# EAGLE design rtc_version2 (EAGLE 5.11)
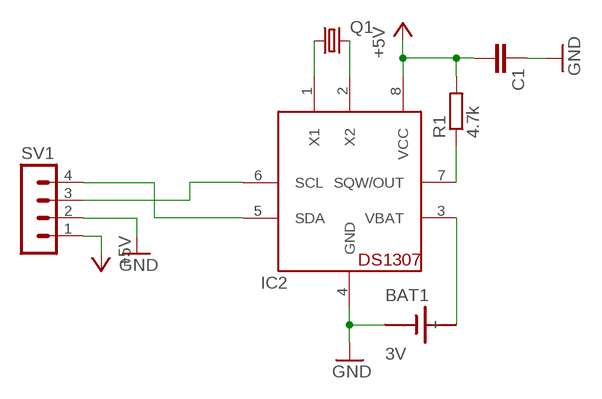
[diagram p0: schematic, sheet 1]

## Parts
BAT1  3V  SN2032  [SN2032]
C1  CAPPTH2  [CAP-PTH-SMALL2]
IC2  DS1307  [DIL08]
Q1  CRYSTALTC38H  [TC38H]
R1  4.7k  R-EU_0207/7  [0207/7]
SV1  MA04-1  [MA04-1]

## Nets
+5V: C1.2 IC2.8(VCC) R1.2 SV1.1
GND: BAT1.- C1.1 IC2.4(GND) SV1.2
N$1: IC2.2(X2) Q1.2
N$2: IC2.1(X1) Q1.1
N$3: BAT1.+ IC2.3(VBAT)
N$5: IC2.7(SQW/OUT) R1.1
SCL: IC2.6(SCL) SV1.3
SDA: IC2.5(SDA) SV1.4

## Library data of the parts
BAT1 = sn2032:SN2032: LI BATTERY
C1 = SparkFun:CAP: Capacitor Standard 0603 ceramic capacitor, and 0.1" leaded capacitor.
IC2 = adafruit:DS1307: DS1307 Real time clock (RTC) with battery backup ability. Talk to it via i2c
Q1 = SparkFun:CRYSTAL: Crystals Various standard crystals. Proven footprints. Spark Fun Electronics SKU : COM-00534
R1 = rcl:R-EU_: RESISTOR, European symbol
SV1 = con-lstb:MA04-1: PIN HEADER; OC_FARNELL: unknown; OC_NEWARK: unknown

## Board
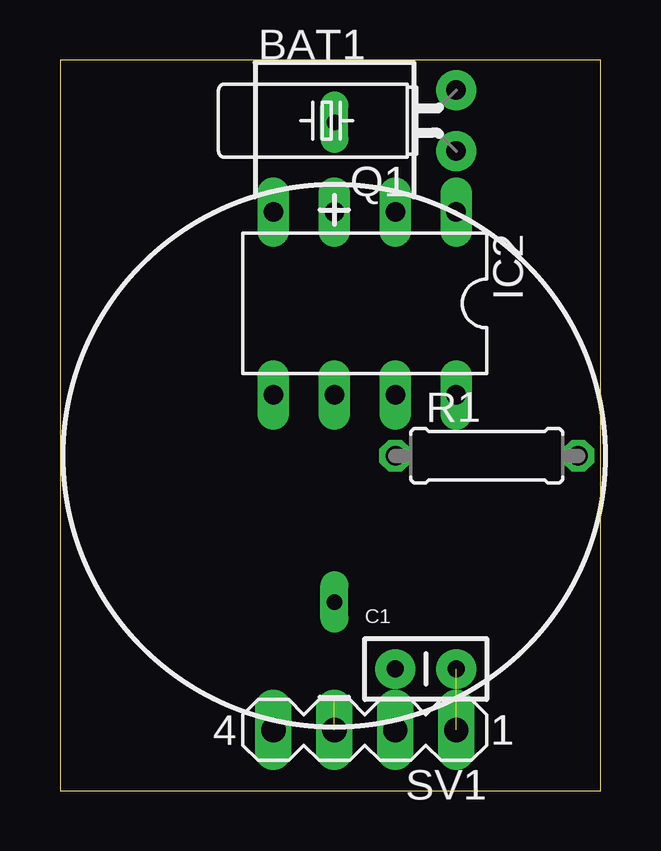
[diagram p1: board, top side]
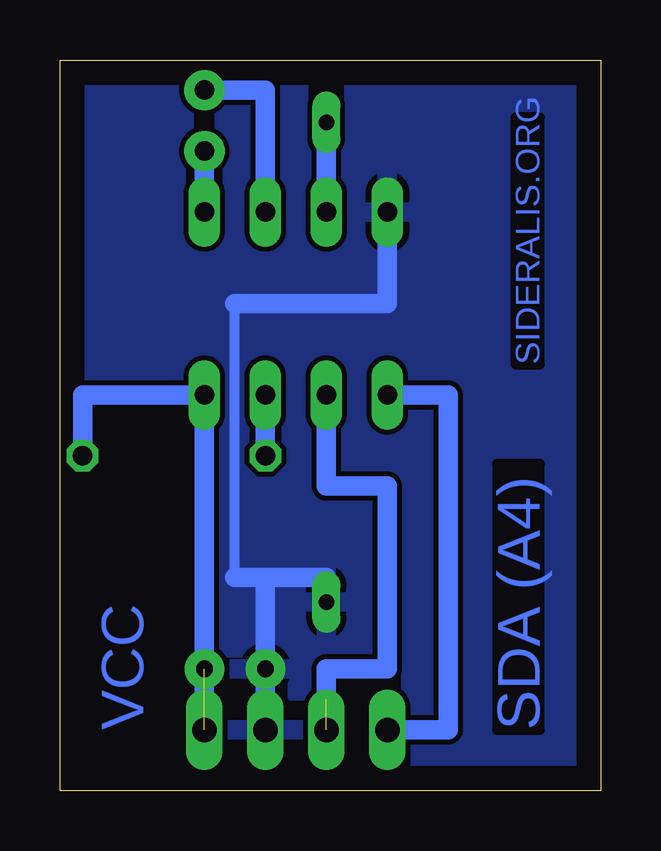
[diagram p2: board, bottom side, seen from below]

Size 22.53 x 30.47 mm. Coordinates in mm from the lower left corner, seen from the top.
Outline: 0,0 22.53,0 22.53,30.47 0,30.47 0,0
Copper layers (1*16): Top 0.035mm / dielectric 1.5mm / Bottom 0.035mm
Design rules "default *": minimum track width 10mil, minimum drill 24mil, track to track 8mil, track to pad 8mil, pad to pad 8mil, via to via 8mil, smd to smd 8mil, copper to edge 40mil, drill to drill 8mil, minimum pad ring 10mil, minimum via ring 8mil, stop-mask expansion 4mil, vias tented up to drill 0mil, thermal gap 10mil

### Footprints (pad centres in the part's own frame; a part is rotated, then mirrored left to right if it is on the bottom)
SN2032 = drill 0.65 long: + 0,13.9; - 0,-6.1
CAP-PTH-SMALL2 = drill 0.7 pad 1.651 round: 1 0,0; 2 2.54,0
DIL08 = drill 0.813 long: 1 -3.81,-3.81; 2 -1.27,-3.81; 3 1.27,-3.81; 4 3.81,-3.81; 5 3.81,3.81; 6 1.27,3.81; 7 -1.27,3.81; 8 -3.81,3.81
TC38H = drill 0.813 pad 1.676 round: 1 -1.27,0; 2 1.27,0
0207/7 = drill 0.813 octagon: 1 -3.81,0; 2 3.81,0
MA04-1 = drill 1.016 long: 1 -3.81,0; 2 -1.27,0; 3 1.27,0; 4 3.81,0

### Placement (x,y rotation side)
BAT1  11.43,13.97 0 top
C1  13.97,5.08 0 top
IC2  12.7,20.32 180 top
Q1  16.51,27.94 90 top
R1  17.78,13.97 0 top
SV1  12.7,2.54 180 top

### Tracks (layer width: path | path; a pad name or v marks a point on that pad's centre or on a via)
+5V  (1 unrouted)
  Bottom 0.813: R1.2 21.59,16.51 IC2.8 SV1.1
GND
  Bottom 0.406: 15.24,8.89 15.24,20.32
  Bottom 0.813: SV1.2 C1.1 13.97,8.89 | 13.97,8.89 11.43,8.89 BAT1.- | 13.97,8.89 15.24,8.89 | 15.24,20.32 8.89,20.32 8.89,22.86
  pour Bottom: -3.81,34.29 26.67,34.29 26.67,-2.54 -3.81,-2.54
N$1
  Bottom 0.813: IC2.2 13.97,29.21 Q1.2
N$2
  Bottom 0.813: IC2.1 Q1.1
N$3
  Bottom 0.254: BAT1.+ 11.43,27.94
  Bottom 0.813: IC2.3 BAT1.+
N$5
  Bottom 0.813: R1.1 IC2.7
SCL  (1 unrouted)
  Bottom 0.813: IC2.6 11.43,12.7 8.89,12.7 8.89,5.08 11.43,5.08 11.43,3.81
SDA
  Bottom 0.813: IC2.5 6.35,16.51 6.35,2.54 SV1.4

### Text on the board
Bottom: 2 SCL (A5) | 3 GND | SIDERALIS.ORG | SDA (A4) | VCC